# Altium schematic sheet H_BRIGGE_1.SchDoc
size A; SheetNumber: 4; SheetTotal: 4
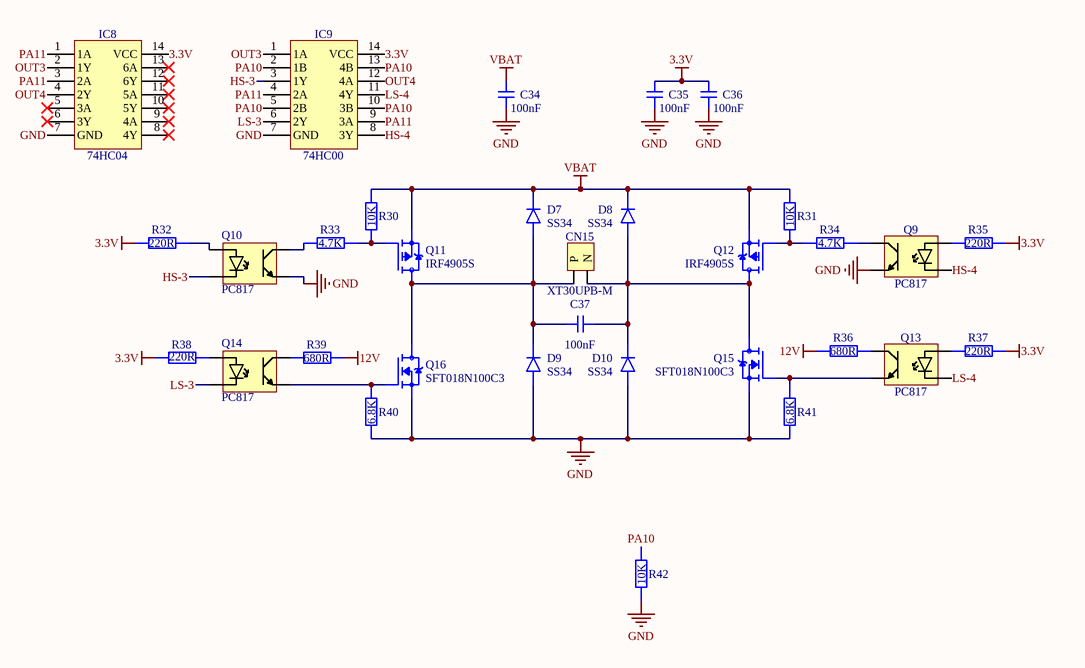
[diagram p0: H_BRIGGE_1.SchDoc]

## Parts
C34  100nF  [CAP-0603-2]
C35  100nF  [CAP-0603-2]
C36  100nF  [CAP-0603-2]
C37  100nF  [CAP-0603-2]
CN15  XT30UPB-M  [XT30UPB-M]
D7  SS34  [SMA(DO-214AC)]
D8  SS34  [SMA(DO-214AC)]
D9  SS34  [SMA(DO-214AC)]
D10  SS34  [SMA(DO-214AC)]
IC8  74HC04  [SOP-14]
IC9  74HC00  [SOP-14]
Q9  PC817  [SOP-4]
Q10  PC817  [SOP-4]
Q11  IRF4905S  [TO-263]
Q12  IRF4905S  [TO-263]
Q13  PC817  [SOP-4]
Q14  PC817  [SOP-4]
Q15  SFT018N100C3  [TOLL]
Q16  SFT018N100C3  [TOLL]
R30  10K  [RES-0603-1]
R31  10K  [RES-0603-1]
R32  220R  [RES-0603-1]
R33  4.7K  [RES-0603-1]
R34  4.7K  [RES-0603-1]
R35  220R  [RES-0603-1]
R36  680R  [RES-0603-1]
R37  220R  [RES-0603-1]
R38  220R  [RES-0603-1]
R39  680R  [RES-0603-1]
R40  6.8K  [RES-0603-1]
R41  6.8K  [RES-0603-1]
R42  10K  [RES-0603-1]

## Nets
3.3V: C35.1 C36.1 IC8.14(VCC) IC9.14(VCC) R32.2 R35.1 R37.1 R38.2
12V: R36.2 R39.2
GND: C34.2 C35.2 C36.2 D9.1(A) D10.1(A) IC8.7(GND) IC9.7(GND) Q9.3(E) Q10.3(E) Q15.2(S) Q16.2(S) R40.1 R41.1 R42.1
VBAT: C34.1 D7.2(K) D8.2(K) Q11.3(S) Q12.3(S) R30.2 R31.2
HS-3: IC9.3(1Y) Q10.2(K)
HS-4: IC9.8(3Y) Q9.2(K)
LS-3: IC9.6(2Y) Q14.2(K)
LS-4: IC9.11(4Y) Q13.2(K)
OUT3: IC8.2(1Y) IC9.1(1A)
OUT4: IC8.4(2Y) IC9.12(4A)
PA10: IC9.2(1B) IC9.5(2B) IC9.10(3B) IC9.13(4B) R42.2
PA11: IC8.1(1A) IC8.3(2A) IC9.4(2A) IC9.9(3A)
NetC37_1: C37.1 CN15.2(N) D8.1(A) D10.2(K) Q12.2(D) Q15.3(D)
NetC37_2: C37.2 CN15.1(P) D7.1(A) D9.2(K) Q11.2(D) Q16.3(D)
NetQ9_1: Q9.1(A) R35.2
NetQ9_4: Q9.4(C) R34.2
NetQ10_1: Q10.1(A) R32.1
NetQ10_4: Q10.4(C) R33.1
NetQ11_1: Q11.1(G) R30.1 R33.2
NetQ12_1: Q12.1(G) R31.1 R34.1
NetQ13_1: Q13.1(A) R37.2
NetQ13_3: Q13.3(E) Q15.1(G) R41.2
NetQ13_4: Q13.4(C) R36.1
NetQ14_1: Q14.1(A) R38.1
NetQ14_3: Q14.3(E) Q16.1(G) R40.2
NetQ14_4: Q14.4(C) R39.1

Not connected (* = marked no-connect by the designer): IC8 5(3A)* 6(3Y)* 8(4Y)* 9(4A)* 10(5Y)* 11(5A)* 12(6Y)* 13(6A)*

## Library data of the parts
C34-C37 = CL10B104KB8NNNC: 100nF ±10% 50V Ceramic Capacitor X7R 0603; Manufacturer: Samsung Electro-Mechanics; Package: 0603; LCSC Part #: C1591; Mfr.Part #: CL10B104KB8NNNC; DigiKey Part Number: 1276-1000-2-ND; ComponentLink1Description: Link; ComponentLink1URL: https://www.lcsc.com/product-detail/C1591.html?s_z=n_CL10B104KB8NNC; ComponentLink2Description: Link 1; ComponentLink2URL: https://www.digikey.com/en/products/detail/samsung-electro-mechanics/CL10B104KB8NNNC/3886658?s=N4IgTCBcDaIMIBkCMAGAQqgLAaTQDgDki4QBdAXyA
CN15 = XT30UPB-M: Banana and Tip Connector Adapters; Manufacturer: Changzhou Amass Elec; Mfr.Part #: XT30PW-M30.G.Y; LCSC Part #: C428721; Package: Through Hole; DigiKey Part Number: NO; ComponentLink1Description: Link; ComponentLink1URL: https://www.lcsc.com/product-detail/C431092.html?s_z=n_xt30; ComponentLink2Description: Link 1
D7-D10 = SS34: Diode Independent 40V 3A Surface Mount SMA(DO-214AC); Manufacturer: GOODWORK; Mfr.Part #: SS34; Package: SMA(DO-214AC); LCSC Part #: C908680; DigiKey Part Number: NO; ComponentLink1Description: Link; ComponentLink1URL: https://www.lcsc.com/product-detail/C908680.html?s_z=n_C908680
IC8 = SN74HC04DR: 2V~6V 16ns@6V,50pF 2uA 6 1 SOIC-14 Gates and Inverters RoHS; Manufacturer: TI; Mfr.Part #: SN74HC04DR; Package: SOIC-14; LCSC Part #: C6811; DigiKey Part Number: 296-1189-2-ND; ComponentLink1Description: Link; ComponentLink1URL: https://www.lcsc.com/product-detail/C6811.html?s_z=n_74HC04; ComponentLink2Description: Link 1; ComponentLink2URL: https://www.digikey.com/en/products/detail/texas-instruments/SN74HC04DR/276832
IC9 = SN74HC00DR: 2uA 2V~6V 15ns@6V,50pF SOIC-14 Gates and Inverters RoHS; Manufacturer: TI; Mfr.Part #: SN74HC00DR; Package: SOIC-14; LCSC Part #: C10090; DigiKey Part Number: 296-1187-2-ND; ComponentLink1Description: Link; ComponentLink1URL: https://www.lcsc.com/product-detail/C10090.html?s_z=n_74hc00; ComponentLink2Description: Link 1; ComponentLink2URL: https://www.digikey.com/en/products/detail/texas-instruments/SN74HC00DR/276830
Q9 Q10 Q13 Q14 = PC817C-S: Phototransistor Output 5kVrms 1 Channel SOP-4-2.54mm; Manufacturer: UMW; Mfr.Part #: PC817C-S; Package: SOP-4-2.54mm; LCSC Part #: C3008369; DigiKey Part Number: NO; ComponentLink1Description: Link; ComponentLink1URL: https://www.lcsc.com/product-detail/C3008369.html?s_z=n_C3008369; ComponentLink2Description: Link 1
Q11 Q12 = IRF4905STRLPBF: P-Channel 55V 70A 170W Surface Mount D2PAK; Manufacturer: Infineon; Package: D2PAK; Mfr.Part #: IRF4905STRLPBF; LCSC Part #: C2620; DigiKey Part Number: IRF4905STRLPBFTR-ND; ComponentLink1Description: Link; ComponentLink1URL: https://www.lcsc.com/product-detail/C2620.html?s_z=n_IRF4905S; ComponentLink2Description: Link 1; ComponentLink2URL: https://www.digikey.com/en/products/detail/infineon-technologies/IRF4905STRLPBF/1928283?s=N4IgTCBcDaIJICUBiAWAnABgKwGUAqCAMgAoBCSIAugL5A
Q15 Q16 = SFT018N100C3: N-Channel 100V 320A 312W Surface Mount TOLL; Manufacturer: SCILICON; Package: TOLL; Mfr.Part #: SFT018N100C3; LCSC Part #: C42395330; DigiKey Part Number: NO; ComponentLink1Description: Link; ComponentLink1URL: https://www.lcsc.com/product-detail/C42395330.html?s_z=n_c42395330; ComponentLink2Description: Link 1
R30 R31 R42 = RC0603FR-0710KL: 100mW 10kΩ 75V Thick Film Resistor ±100ppm/℃ ±1% 0603 Chip Resistor - Surface Mount RoHS; Manufacturer: YAGEO; Package: 0603; LCSC Part #: C98220; Mfr.Part #: RC0603FR-0710KL; DigiKey Part Number: 311-10.0KHRTR-ND; ComponentLink1Description: Link; ComponentLink1URL: https://www.lcsc.com/product-detail/C98220.html?s_z=n_C98220; ComponentLink2Description: Link 1; ComponentLink2URL: https://www.digikey.com/en/products/detail/yageo/RC0603FR-0710KL/726880?s=N4IgTCBcDaIMwEYEFoEAYB0aDSAJASgCr7IByAIiALoC%2BQA
R32 R35 R37 R38 = 0603WAF2200T5E: 220Ω ±1% 100mW 0603 Thick Film Resistor; Manufacturer: UNI-ROYAL; Mfr.Part #: 0603WAF2200T5E; Package: 0603; LCSC Part #: C22962; DigiKey Part Number: NO; ComponentLink1Description: Link; ComponentLink1URL: https://www.lcsc.com/product-detail/C22962.html?s_z=n_0603waf22; ComponentLink2Description: Link 1
R33 R34 = RC0603FR-074K7L: 100mW 4.7kΩ 75V Thick Film Resistor ±100ppm/℃ ±1% 0603 Chip Resistor - Surface Mount RoHS; Manufacturer: YAGEO; Mfr.Part #: RC0603FR-074K7L; Package: 0603; LCSC Part #: C99782; DigiKey Part Number: 311-4.70KHRTR-ND; ComponentLink1Description: Link; ComponentLink1URL: https://www.lcsc.com/product-detail/C99782.html?s_z=n_4.7K; ComponentLink2Description: Link 1; ComponentLink2URL: https://www.digikey.com/en/products/detail/yageo/RC0603FR-074K7L/727212?s=N4IgTCBcDaIEoGEAMA2JBmAYnAtEg7ACwDS%2BAMiALoC%2BQA
R36 R39 = FRC0603F6800TS: 680Ω ±1% 100mW 0603 Thick Film Resistor; Manufacturer: FOJAN; Mfr.Part #: FRC0603F6800TS; Package: 0603; LCSC Part #: C2907062; DigiKey Part Number: NO; ComponentLink1Description: Link; ComponentLink1URL: https://www.lcsc.com/product-detail/C2907062.html?s_z=n_680r; ComponentLink2Description: Link 1
R40 R41 = 0603WAF6801T5E: 6.8kΩ ±1% 100mW 0603 Thick Film Resistor; Manufacturer: UNI-ROYAL; Mfr.Part #: 0603WAF6801T5E; Package: 0603; LCSC Part #: C23212; DigiKey Part Number: NO; ComponentLink1Description: Link; ComponentLink1URL: https://www.lcsc.com/product-detail/C23212.html?s_z=n_C23212; ComponentLink2Description: Link 1